# Altium schematic sheet LED16_23.SchDoc
size A4
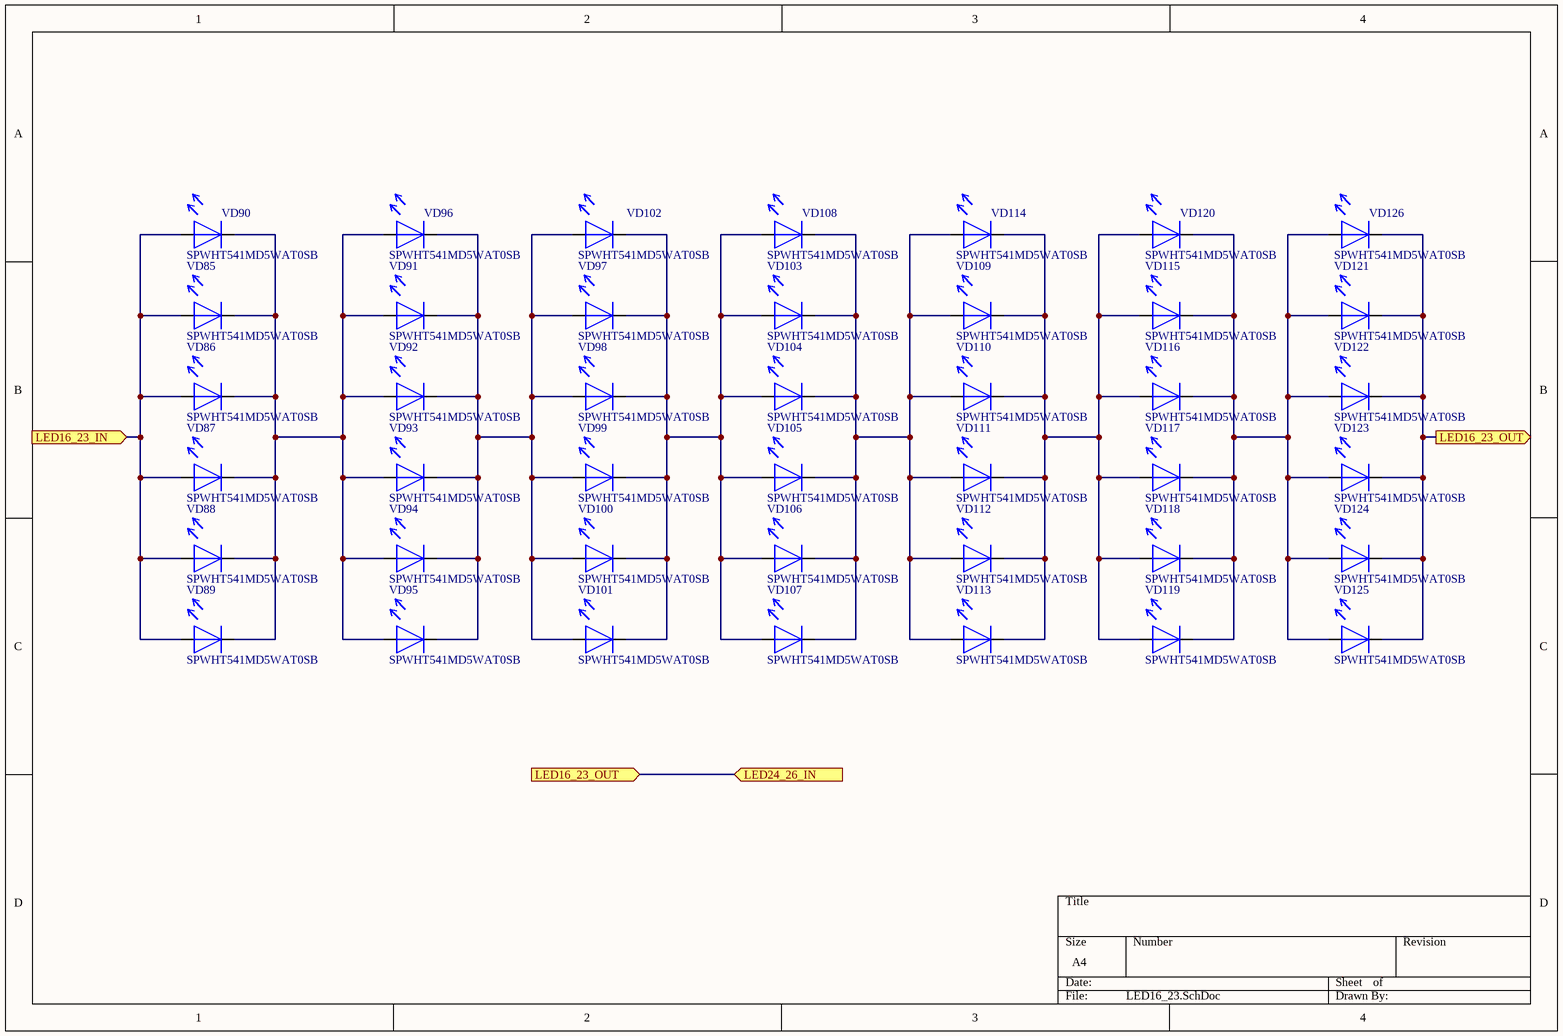
[diagram p0: LED16_23.SchDoc]

## Parts
VD85  SPWHT541MD5WAT0SB  [LED_SAMSUNG]
VD86  SPWHT541MD5WAT0SB  [LED_SAMSUNG]
VD87  SPWHT541MD5WAT0SB  [LED_SAMSUNG]
VD88  SPWHT541MD5WAT0SB  [LED_SAMSUNG]
VD89  SPWHT541MD5WAT0SB  [LED_SAMSUNG]
VD90  SPWHT541MD5WAT0SB  [LED_SAMSUNG]
VD91  SPWHT541MD5WAT0SB  [LED_SAMSUNG]
VD92  SPWHT541MD5WAT0SB  [LED_SAMSUNG]
VD93  SPWHT541MD5WAT0SB  [LED_SAMSUNG]
VD94  SPWHT541MD5WAT0SB  [LED_SAMSUNG]
VD95  SPWHT541MD5WAT0SB  [LED_SAMSUNG]
VD96  SPWHT541MD5WAT0SB  [LED_SAMSUNG]
VD97  SPWHT541MD5WAT0SB  [LED_SAMSUNG]
VD98  SPWHT541MD5WAT0SB  [LED_SAMSUNG]
VD99  SPWHT541MD5WAT0SB  [LED_SAMSUNG]
VD100  SPWHT541MD5WAT0SB  [LED_SAMSUNG]
VD101  SPWHT541MD5WAT0SB  [LED_SAMSUNG]
VD102  SPWHT541MD5WAT0SB  [LED_SAMSUNG]
VD103  SPWHT541MD5WAT0SB  [LED_SAMSUNG]
VD104  SPWHT541MD5WAT0SB  [LED_SAMSUNG]
VD105  SPWHT541MD5WAT0SB  [LED_SAMSUNG]
VD106  SPWHT541MD5WAT0SB  [LED_SAMSUNG]
VD107  SPWHT541MD5WAT0SB  [LED_SAMSUNG]
VD108  SPWHT541MD5WAT0SB  [LED_SAMSUNG]
VD109  SPWHT541MD5WAT0SB  [LED_SAMSUNG]
VD110  SPWHT541MD5WAT0SB  [LED_SAMSUNG]
VD111  SPWHT541MD5WAT0SB  [LED_SAMSUNG]
VD112  SPWHT541MD5WAT0SB  [LED_SAMSUNG]
VD113  SPWHT541MD5WAT0SB  [LED_SAMSUNG]
VD114  SPWHT541MD5WAT0SB  [LED_SAMSUNG]
VD115  SPWHT541MD5WAT0SB  [LED_SAMSUNG]
VD116  SPWHT541MD5WAT0SB  [LED_SAMSUNG]
VD117  SPWHT541MD5WAT0SB  [LED_SAMSUNG]
VD118  SPWHT541MD5WAT0SB  [LED_SAMSUNG]
VD119  SPWHT541MD5WAT0SB  [LED_SAMSUNG]
VD120  SPWHT541MD5WAT0SB  [LED_SAMSUNG]
VD121  SPWHT541MD5WAT0SB  [LED_SAMSUNG]
VD122  SPWHT541MD5WAT0SB  [LED_SAMSUNG]
VD123  SPWHT541MD5WAT0SB  [LED_SAMSUNG]
VD124  SPWHT541MD5WAT0SB  [LED_SAMSUNG]
VD125  SPWHT541MD5WAT0SB  [LED_SAMSUNG]
VD126  SPWHT541MD5WAT0SB  [LED_SAMSUNG]

## Ports
LED16_23_IN (in), LED16_23_OUT (in), LED16_23_OUT (out), LED24_26_IN (in)

## Nets
LED16_23_IN: VD85.1 VD86.1 VD87.1 VD88.1 VD89.1 VD90.1 ; port LED16_23_IN
LED16_23_OUT: VD121.2 VD122.2 VD123.2 VD124.2 VD125.2 VD126.2 ; port LED16_23_OUT, port LED24_26_IN
NetVD85_2: VD85.2 VD86.2 VD87.2 VD88.2 VD89.2 VD90.2 VD91.1 VD92.1 VD93.1 VD94.1 VD95.1 VD96.1
NetVD91_2: VD91.2 VD92.2 VD93.2 VD94.2 VD95.2 VD96.2 VD97.1 VD98.1 VD99.1 VD100.1 VD101.1 VD102.1
NetVD97_2: VD97.2 VD98.2 VD99.2 VD100.2 VD101.2 VD102.2 VD103.1 VD104.1 VD105.1 VD106.1 VD107.1 VD108.1
NetVD103_2: VD103.2 VD104.2 VD105.2 VD106.2 VD107.2 VD108.2 VD109.1 VD110.1 VD111.1 VD112.1 VD113.1 VD114.1
NetVD109_2: VD109.2 VD110.2 VD111.2 VD112.2 VD113.2 VD114.2 VD115.1 VD116.1 VD117.1 VD118.1 VD119.1 VD120.1
NetVD115_2: VD115.2 VD116.2 VD117.2 VD118.2 VD119.2 VD120.2 VD121.1 VD122.1 VD123.1 VD124.1 VD125.1 VD126.1

## Library data of the parts
VD85-VD126 = LED SPWHT541MD5WAT0SB: Value: SPWHT541MD5WAT0SB